# EAGLE design Trinkey-DualSwitch-Concept2 (EAGLE 9.6.2)
AUTHOR: ladyada
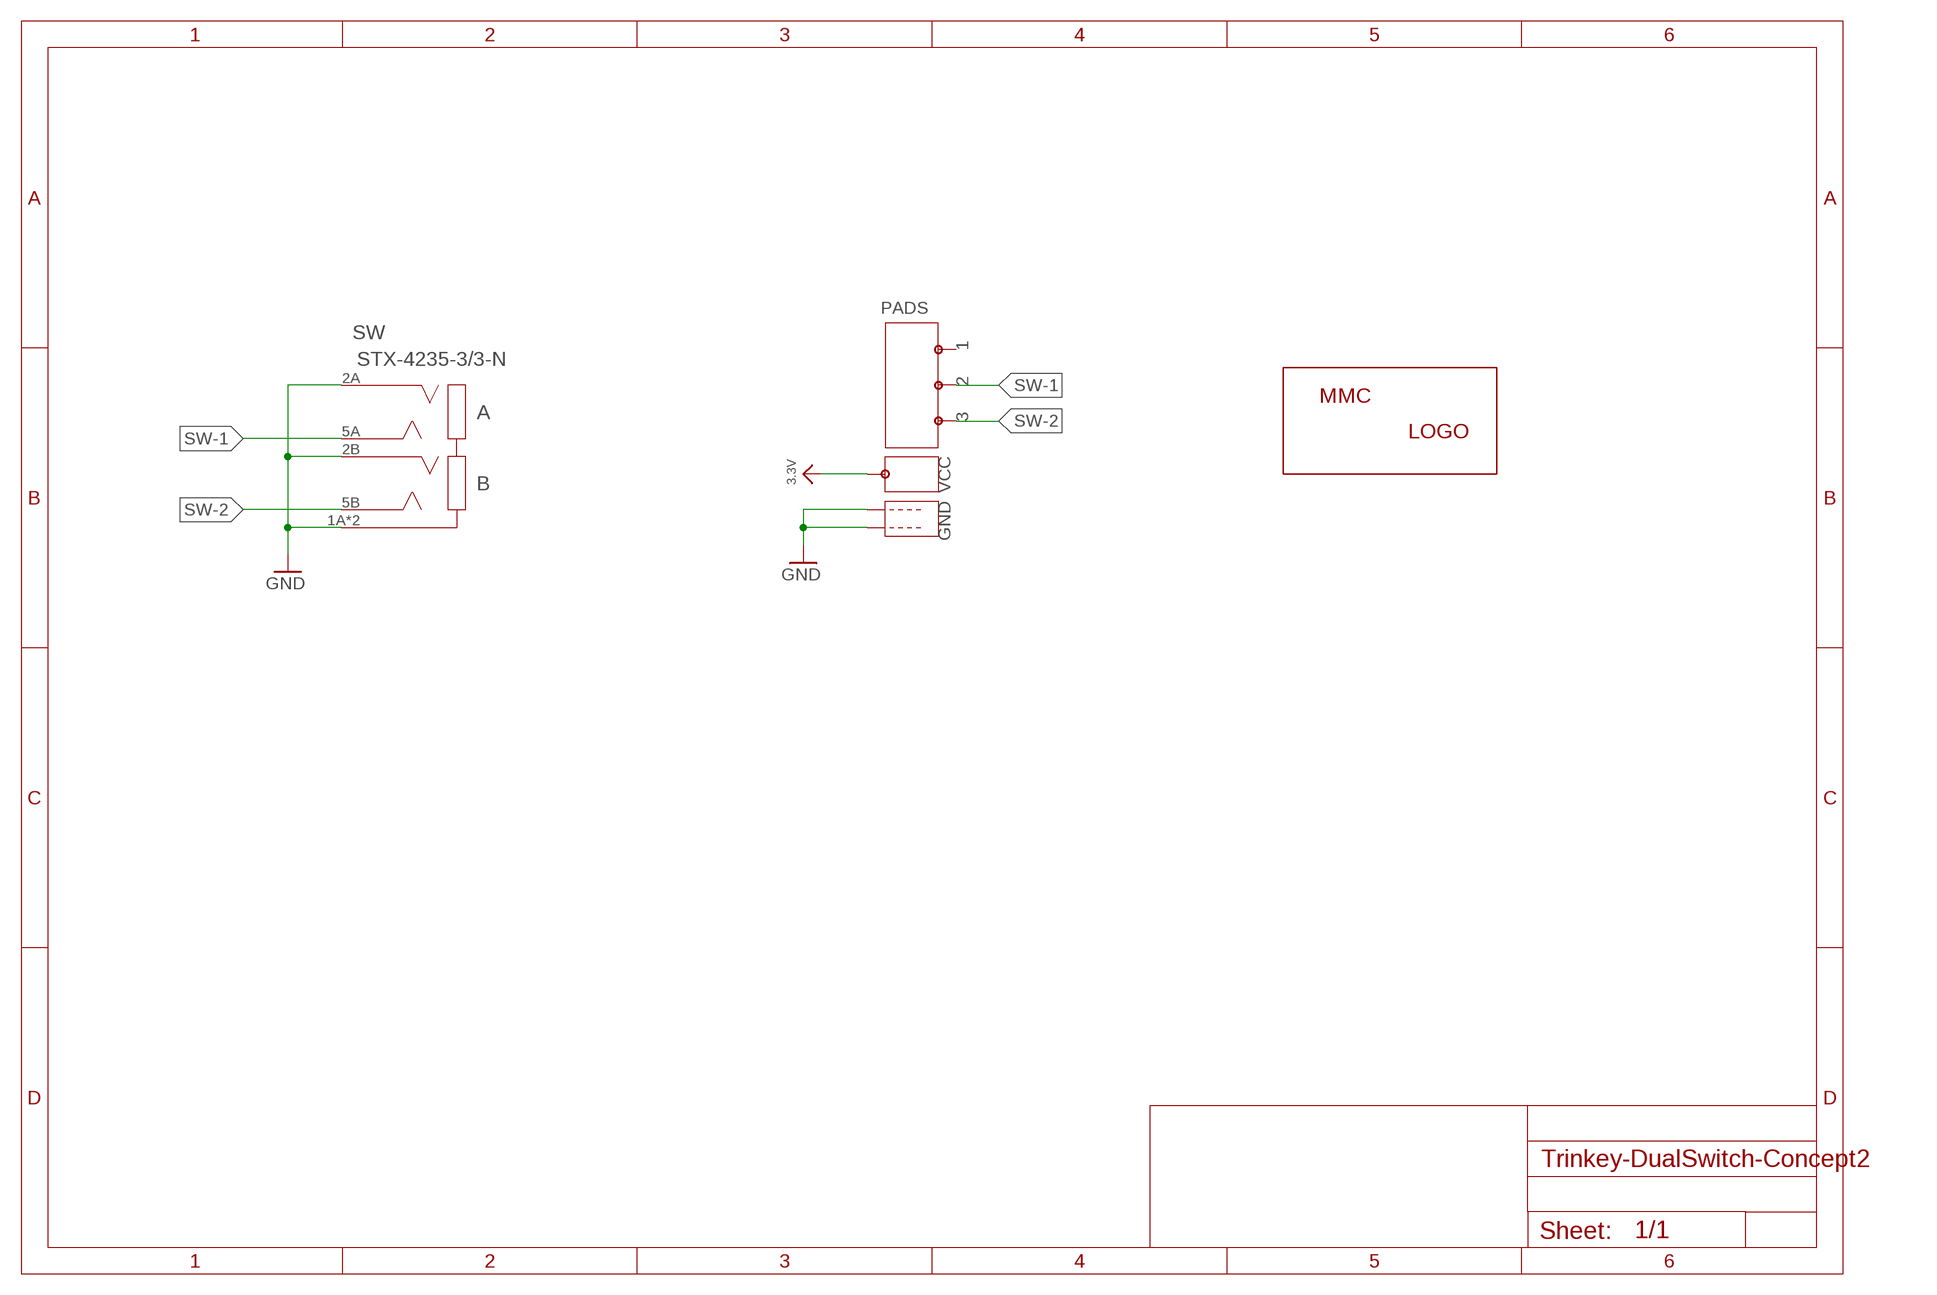
[diagram p0: schematic, sheet 1]

## Parts
LABEL_LOGO  MMC_LOGO-XSM  [MMC_X-SMALL_LOGO]
PADS  CASTELLATED-ROTARY-TRINKEY  [CASTELLATED-ROTARY-TRINKEY]
SW  STX-4235-3/3-N  [STX-4235-3/3]

## Nets
3.3V: PADS.P$VCC
GND: PADS.P$GND1 PADS.P$GND2 SW.1A(1AB) SW.1B(1AB) SW.2A SW.2B
SW-1: PADS.P$S2 SW.5A
SW-2: PADS.P$S3 SW.5B
Unconnected: PADS.P$S1

## Library data of the parts
LABEL_LOGO = MMC Eagle:MMC_LOGO-
PADS = MMC Eagle:CASTELLATED-ROTARY-TRINKEY: Rotary Encoder with Built-In Switch PEC11 - 24 Step, PEC11-4215F-S24 - http://www.adafruit.com/products/377
SW = MMC Eagle:STX-4235-3/3

## Board
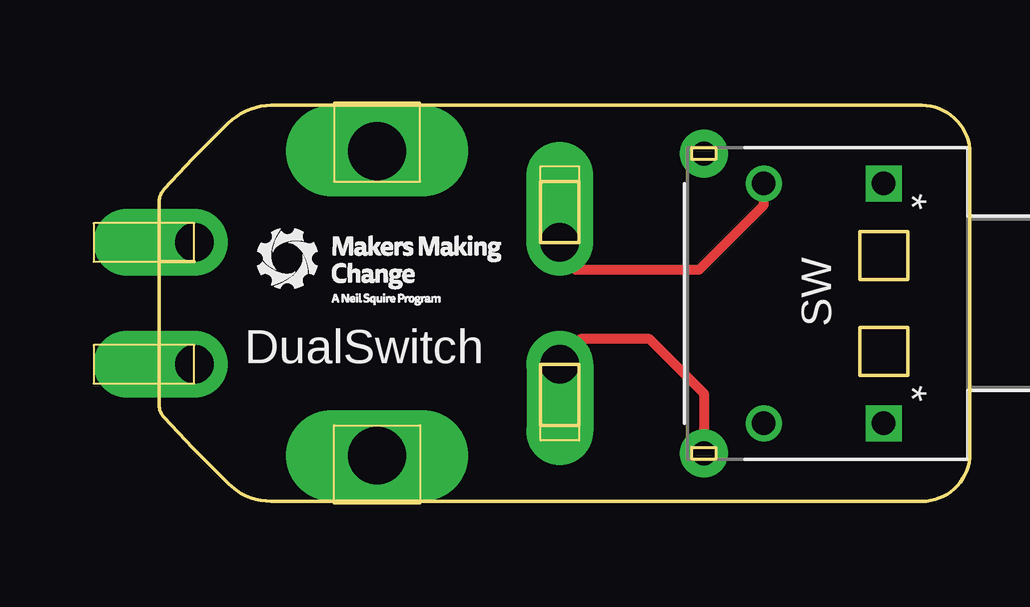
[diagram p1: board, top side]
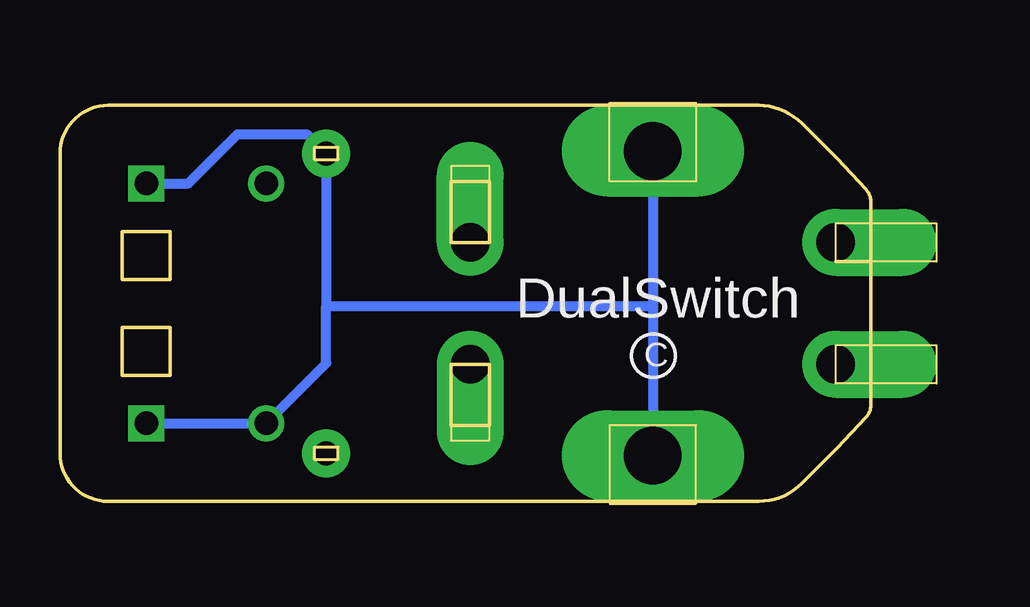
[diagram p2: board, bottom side, seen from below]

Size 33.8 x 16.51 mm. Coordinates in mm from the lower left corner, seen from the top.
Outline: 0,9.99 1.46,9.99
Outline: 0.2,13.02 1.4,14.29 2.88,15.77 arc-45 4.67,16.51 31.8,16.51 arc-90 33.8,14.51 33.8,2 arc-90 31.8,0 4.67,0 arc-45 2.88,0.74 1.4,2.22 0.2,3.49 arc-35 0,3.94 0,12.57 arc-35 0.2,13.02
Outline: 15.9,3.17 15.9,5.71 17.5,5.71 17.5,3.17 15.9,3.17
Outline: 15.9,10.79 15.9,13.34 17.5,13.34 17.5,10.79 15.9,10.79
Copper layers (1*16): Top 0.035mm / dielectric 1.5mm / Bottom 0.035mm
Design rules "adafruit 8-8 *": minimum track width 8mil, minimum drill 15.5mil, track to track 8mil, track to pad 8mil, pad to pad 8mil, via to via 8mil, smd to smd 8mil, copper to edge 10mil, drill to drill 8mil, minimum pad ring 10mil, minimum via ring 8mil, stop-mask expansion 2mil, vias tented up to drill 20mil, thermal gap 10mil

### Footprints (pad centres in the part's own frame; a part is rotated, then mirrored left to right if it is on the bottom)
CASTELLATED-ROTARY-TRINKEY = drill 2.4 pad 3.8 long: P$GND1 -6.35,0; P$GND2 6.35,0 | drill 1.6 pad 2.8 offset: P$S1 2.54,7.62; P$S2 2.54,-7.62; P$S3 -2.54,-7.62; P$VCC -2.54,7.62
STX-4235-3/3 = drill 0.991 pad 1.499 square: 1A -5,0; 1B 5,0 | drill 1 pad 2: 2A -6.25,-7.5; 5A 6.25,-7.5 | drill 0.991 pad 1.499: 2B 5,-5; 5B -5,-5

### Placement (x,y rotation side)
LABEL_LOGO  9.08,8.2 0 top
PADS  9.08,8.26 270 bottom
SW  30.2,8.26 270 top

### Tracks (layer width: path | path; a pad name or v marks a point on that pad's centre or on a via)
GND
  Bottom 0.406: PADS.P$GND1 9.08,8.15 | 9.08,8.15 PADS.P$GND2 | 22.7,8.15 9.08,8.15 | 22.7,8.15 SW.2A 23.5,15.3 26.4,15.3 28.45,13.26 SW.1A | 22.7,8.15 22.7,5.75 SW.2B SW.1B
SW-1
  Top 0.406: PADS.P$S2 16.7,5.92 17.55,6.76 20.44,6.76 22.7,4.5 SW.5A
SW-2
  Top 0.406: PADS.P$S3 16.7,10.29 17.35,9.64 22.49,9.64 25.2,12.36 SW.5B

### Text on the board
tPlace: DualSwitch
bPlace: DualSwitch | C